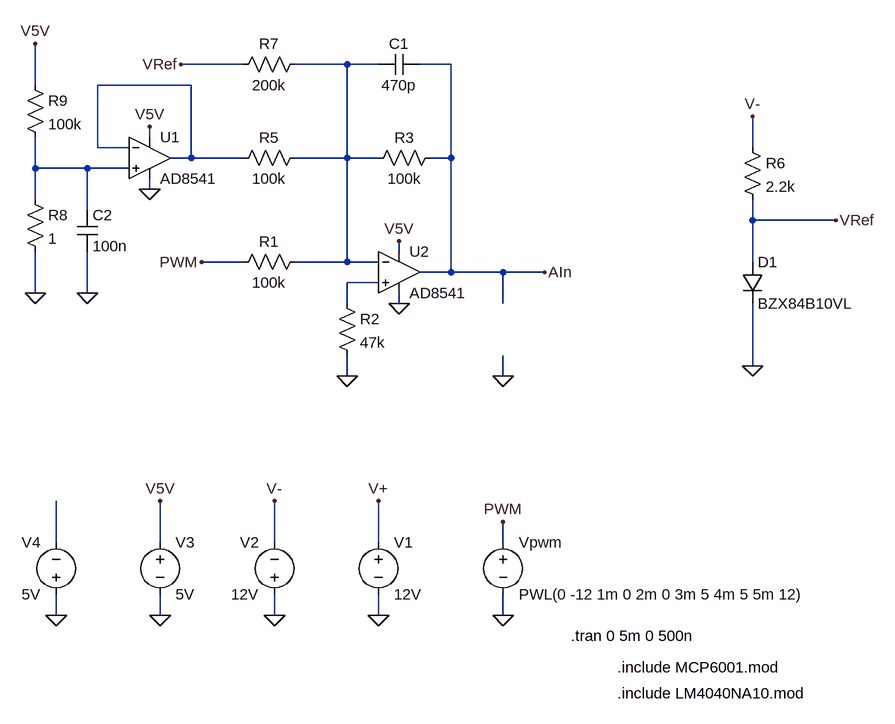
[diagram p0: schematic CVIn.asc]
CVIn.asc, the LTspice schematic file:
Version 4
SHEET 1 2248 680
WIRE -320 -608 -416 -608
WIRE -160 -608 -240 -608
WIRE -112 -608 -160 -608
WIRE 0 -608 -48 -608
WIRE -640 -576 -640 -640
WIRE -400 -576 -544 -576
WIRE -464 -496 -464 -512
WIRE -544 -480 -544 -576
WIRE -496 -480 -544 -480
WIRE 464 -480 464 -528
WIRE -400 -464 -400 -576
WIRE -400 -464 -432 -464
WIRE -320 -464 -400 -464
WIRE -160 -464 -160 -608
WIRE -160 -464 -240 -464
WIRE -112 -464 -160 -464
WIRE 0 -464 0 -608
WIRE 0 -464 -32 -464
WIRE -640 -448 -640 -496
WIRE -560 -448 -640 -448
WIRE -496 -448 -560 -448
WIRE -464 -416 -464 -432
WIRE -640 -400 -640 -448
WIRE -560 -384 -560 -448
WIRE 464 -368 464 -400
WIRE 592 -368 464 -368
WIRE -80 -320 -80 -336
WIRE -320 -304 -384 -304
WIRE -160 -304 -160 -464
WIRE -160 -304 -240 -304
WIRE -112 -304 -160 -304
WIRE 464 -304 464 -368
WIRE 0 -288 0 -464
WIRE 0 -288 -48 -288
WIRE 80 -288 0 -288
WIRE 144 -288 80 -288
WIRE -112 -272 -160 -272
WIRE -640 -256 -640 -320
WIRE -560 -256 -560 -320
WIRE -160 -240 -160 -272
WIRE -80 -240 -80 -256
WIRE 80 -240 80 -288
WIRE 464 -144 464 -240
WIRE -160 -128 -160 -160
WIRE 80 -128 80 -160
WIRE -608 128 -608 64
WIRE -448 128 -448 64
WIRE -272 128 -272 64
WIRE -112 128 -112 64
WIRE 80 128 80 96
WIRE -608 240 -608 208
WIRE -448 240 -448 208
WIRE -272 240 -272 208
WIRE -112 240 -112 208
WIRE 80 240 80 208
FLAG 80 240 0
FLAG 80 96 PWM
FLAG -384 -304 PWM
FLAG -112 240 0
FLAG -272 240 0
FLAG -448 240 0
FLAG -448 64 V5V
FLAG -272 64 V-
FLAG -112 64 V+
FLAG 144 -288 AIn
FLAG -80 -240 0
FLAG -80 -336 V5V
FLAG -160 -128 0
FLAG 80 -128 0
FLAG -416 -608 VRef
FLAG -608 240 0
FLAG 592 -368 VRef
FLAG 464 -144 0
FLAG 464 -528 V-
FLAG -640 -256 0
FLAG -640 -640 V5V
FLAG -464 -416 0
FLAG -464 -512 V5V
FLAG -560 -256 0
SYMBOL voltage 80 112 R0
WINDOW 123 0 0 Left 2
WINDOW 39 0 0 Left 2
SYMATTR InstName Vpwm
SYMATTR Value PWL(0 -12 1m 0 2m 0 3m 5 4m 5 5m 12)
SYMBOL res -224 -320 R90
WINDOW 0 0 56 VBottom 2
WINDOW 3 32 56 VTop 2
SYMATTR InstName R1
SYMATTR Value 100k
SYMBOL /voltage -112 112 R0
SYMATTR InstName V1
SYMATTR Value 12V
SYMBOL /voltage -272 224 R180
WINDOW 0 24 96 Left 2
WINDOW 3 24 16 Left 2
SYMATTR InstName V2
SYMATTR Value 12V
SYMBOL /voltage -448 112 R0
SYMATTR InstName V3
SYMATTR Value 5V
SYMBOL /res -176 -256 R0
SYMATTR InstName R2
SYMATTR Value 47k
SYMBOL res -16 -480 R90
WINDOW 0 0 56 VBottom 2
WINDOW 3 32 56 VTop 2
SYMATTR InstName R3
SYMATTR Value 100k
SYMBOL /Opamps/AD8541 -80 -352 R0
SYMATTR InstName U2
SYMBOL res -224 -480 R90
WINDOW 0 0 56 VBottom 2
WINDOW 3 32 56 VTop 2
SYMATTR InstName R5
SYMATTR Value 100k
SYMBOL /voltage -608 224 R180
WINDOW 0 24 96 Left 2
WINDOW 3 24 16 Left 2
SYMATTR InstName V4
SYMATTR Value 5V
SYMBOL /cap -48 -624 R90
WINDOW 0 0 32 VBottom 2
WINDOW 3 32 32 VTop 2
SYMATTR InstName C1
SYMATTR Value 470p
SYMBOL /res 448 -496 R0
SYMATTR InstName R6
SYMATTR Value 2.2k
SYMBOL /diode 448 -304 R0
SYMATTR InstName D1
SYMATTR Value BZX84B10VL
SYMBOL /res -224 -624 R90
WINDOW 0 0 56 VBottom 2
WINDOW 3 32 56 VTop 2
SYMATTR InstName R7
SYMATTR Value 200k
SYMBOL /res -656 -416 R0
SYMATTR InstName R8
SYMATTR Value 1
SYMBOL /res -656 -592 R0
SYMATTR InstName R9
SYMATTR Value 100k
SYMBOL /Opamps/AD8541 -464 -528 R0
SYMATTR InstName U1
SYMBOL /cap -576 -384 R0
SYMATTR InstName C2
SYMATTR Value 100n
TEXT 184 272 Left 2 !.tran 0 5m 0 500n
TEXT 256 320 Left 2 !.include MCP6001.mod
TEXT 256 360 Left 2 !.include LM4040NA10.mod

The netlist it stands for:
* CVIn.asc
Vpwm PWM 0 PWL(0 -12 1m 0 2m 0 3m 5 4m 5 5m 12)
R1 N001 PWM 100k
V1 V+ 0 12V
V2 0 V- 12V
V3 V5V 0 5V
R2 N004 0 47k
R3 AIn N001 100k
XU2 N004 N001 V5V 0 AIn AD8541  ; pins In+ In- V+ V- OUT
R5 N001 N002 100k
V4 0 N005 5V
C1 AIn N001 470p
R6 V- VRef 2.2k
D1 VRef 0 BZX84B10VL
R7 N001 VRef 200k
R8 N003 0 1
R9 V5V N003 100k
XU1 N003 N002 V5V 0 N002 AD8541  ; pins In+ In- V+ V- OUT
C2 N003 0 100n
.model D D
.lib standard.dio
.tran 0 5m 0 500n
.include MCP6001.mod
.include LM4040NA10.mod
.backanno
.end